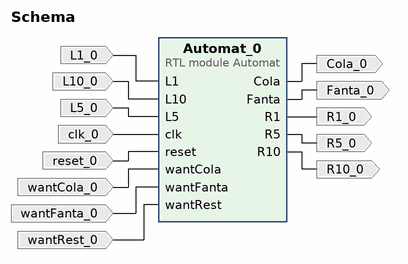
[diagram p0: block diagram of the top level]
# Vivado block design Schema, xc7a100tcsg324-1, Vivado 2020.2
create_bd_design Schema

create_bd_port -dir O Cola_0
create_bd_port -dir O Fanta_0
create_bd_port -dir I L1_0
create_bd_port -dir I L10_0
create_bd_port -dir I L5_0
create_bd_port -dir O R1_0
create_bd_port -dir O R10_0
create_bd_port -dir O R5_0
create_bd_port -dir I -type clk clk_0
create_bd_port -dir I -type rst reset_0
create_bd_port -dir I wantCola_0
create_bd_port -dir I wantFanta_0
create_bd_port -dir I wantRest_0

create_bd_cell -type module -reference Automat Automat_0

# ---- connections ----

connect_bd_net [get_bd_pins Automat_0/Cola] [get_bd_ports Cola_0]
connect_bd_net [get_bd_pins Automat_0/Fanta] [get_bd_ports Fanta_0]
connect_bd_net -net L1_0_1 [get_bd_ports L1_0] [get_bd_pins Automat_0/L1]
connect_bd_net -net L10_0_1 [get_bd_ports L10_0] [get_bd_pins Automat_0/L10]
connect_bd_net -net L5_0_1 [get_bd_ports L5_0] [get_bd_pins Automat_0/L5]
connect_bd_net [get_bd_pins Automat_0/R1] [get_bd_ports R1_0]
connect_bd_net [get_bd_pins Automat_0/R10] [get_bd_ports R10_0]
connect_bd_net [get_bd_pins Automat_0/R5] [get_bd_ports R5_0]
connect_bd_net -net clk_0_1 [get_bd_ports clk_0] [get_bd_pins Automat_0/clk]
connect_bd_net -net reset_0_1 [get_bd_ports reset_0] [get_bd_pins Automat_0/reset]
connect_bd_net -net wantCola_0_1 [get_bd_ports wantCola_0] [get_bd_pins Automat_0/wantCola]
connect_bd_net -net wantFanta_0_1 [get_bd_ports wantFanta_0] [get_bd_pins Automat_0/wantFanta]
connect_bd_net -net wantRest_0_1 [get_bd_ports wantRest_0] [get_bd_pins Automat_0/wantRest]

validate_bd_design
save_bd_design
